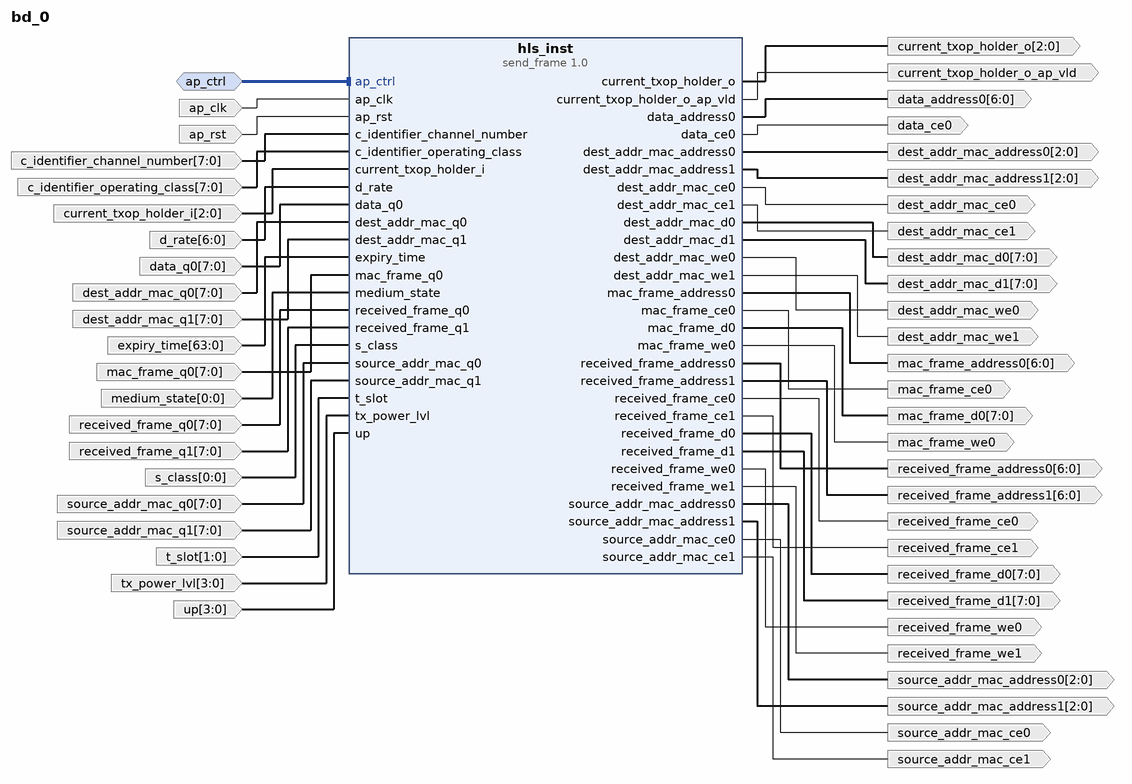
[diagram p0: block diagram of the top level]
# Vivado block design bd_0, xc7a35tcpg236-1, Vivado 2019.2
create_bd_design bd_0

create_bd_intf_port -mode Slave -vlnv xilinx.com:interface:acc_handshake_rtl:1.0 ap_ctrl
create_bd_port -dir I -type clk ap_clk
set_property -dict {CONFIG.FREQ_HZ 100000000.0} [get_bd_ports ap_clk]
create_bd_port -dir I -type rst ap_rst
set_property -dict {CONFIG.POLARITY ACTIVE_HIGH} [get_bd_ports ap_rst]
create_bd_port -dir I -from 7 -to 0 -type data c_identifier_channel_number
create_bd_port -dir I -from 7 -to 0 -type data c_identifier_operating_class
create_bd_port -dir I -from 2 -to 0 -type data current_txop_holder_i
create_bd_port -dir O -from 2 -to 0 -type data current_txop_holder_o
create_bd_port -dir O current_txop_holder_o_ap_vld
create_bd_port -dir I -from 6 -to 0 -type data d_rate
create_bd_port -dir O -from 6 -to 0 -type data data_address0
create_bd_port -dir O data_ce0
create_bd_port -dir I -from 7 -to 0 -type data data_q0
create_bd_port -dir O -from 2 -to 0 -type data dest_addr_mac_address0
create_bd_port -dir O -from 2 -to 0 -type data dest_addr_mac_address1
create_bd_port -dir O dest_addr_mac_ce0
create_bd_port -dir O dest_addr_mac_ce1
create_bd_port -dir O -from 7 -to 0 -type data dest_addr_mac_d0
create_bd_port -dir O -from 7 -to 0 -type data dest_addr_mac_d1
create_bd_port -dir I -from 7 -to 0 -type data dest_addr_mac_q0
create_bd_port -dir I -from 7 -to 0 -type data dest_addr_mac_q1
create_bd_port -dir O dest_addr_mac_we0
create_bd_port -dir O dest_addr_mac_we1
create_bd_port -dir I -from 63 -to 0 -type data expiry_time
create_bd_port -dir O -from 6 -to 0 -type data mac_frame_address0
create_bd_port -dir O mac_frame_ce0
create_bd_port -dir O -from 7 -to 0 -type data mac_frame_d0
create_bd_port -dir I -from 7 -to 0 -type data mac_frame_q0
create_bd_port -dir O mac_frame_we0
create_bd_port -dir I -from 0 -to 0 -type data medium_state
create_bd_port -dir O -from 6 -to 0 -type data received_frame_address0
create_bd_port -dir O -from 6 -to 0 -type data received_frame_address1
create_bd_port -dir O received_frame_ce0
create_bd_port -dir O received_frame_ce1
create_bd_port -dir O -from 7 -to 0 -type data received_frame_d0
create_bd_port -dir O -from 7 -to 0 -type data received_frame_d1
create_bd_port -dir I -from 7 -to 0 -type data received_frame_q0
create_bd_port -dir I -from 7 -to 0 -type data received_frame_q1
create_bd_port -dir O received_frame_we0
create_bd_port -dir O received_frame_we1
create_bd_port -dir I -from 0 -to 0 -type data s_class
create_bd_port -dir O -from 2 -to 0 -type data source_addr_mac_address0
create_bd_port -dir O -from 2 -to 0 -type data source_addr_mac_address1
create_bd_port -dir O source_addr_mac_ce0
create_bd_port -dir O source_addr_mac_ce1
create_bd_port -dir I -from 7 -to 0 -type data source_addr_mac_q0
create_bd_port -dir I -from 7 -to 0 -type data source_addr_mac_q1
create_bd_port -dir I -from 1 -to 0 -type data t_slot
create_bd_port -dir I -from 3 -to 0 -type data tx_power_lvl
create_bd_port -dir I -from 3 -to 0 -type data up

create_bd_cell -type ip -vlnv jt:hls:send_frame:1.0 hls_inst

# ---- connections ----

connect_bd_intf_net -intf_net ap_ctrl_0_1 [get_bd_intf_ports ap_ctrl] [get_bd_intf_pins hls_inst/ap_ctrl]
connect_bd_net -net ap_clk_0_1 [get_bd_ports ap_clk] [get_bd_pins hls_inst/ap_clk]
connect_bd_net -net ap_rst_0_1 [get_bd_ports ap_rst] [get_bd_pins hls_inst/ap_rst]
connect_bd_net -net c_identifier_channel_number_0_1 [get_bd_ports c_identifier_channel_number] [get_bd_pins hls_inst/c_identifier_channel_number]
connect_bd_net -net c_identifier_operating_class_0_1 [get_bd_ports c_identifier_operating_class] [get_bd_pins hls_inst/c_identifier_operating_class]
connect_bd_net -net current_txop_holder_i_0_1 [get_bd_ports current_txop_holder_i] [get_bd_pins hls_inst/current_txop_holder_i]
connect_bd_net [get_bd_pins hls_inst/current_txop_holder_o] [get_bd_ports current_txop_holder_o]
connect_bd_net [get_bd_pins hls_inst/current_txop_holder_o_ap_vld] [get_bd_ports current_txop_holder_o_ap_vld]
connect_bd_net -net d_rate_0_1 [get_bd_ports d_rate] [get_bd_pins hls_inst/d_rate]
connect_bd_net [get_bd_pins hls_inst/data_address0] [get_bd_ports data_address0]
connect_bd_net [get_bd_pins hls_inst/data_ce0] [get_bd_ports data_ce0]
connect_bd_net -net data_q0_0_1 [get_bd_ports data_q0] [get_bd_pins hls_inst/data_q0]
connect_bd_net [get_bd_pins hls_inst/dest_addr_mac_address0] [get_bd_ports dest_addr_mac_address0]
connect_bd_net [get_bd_pins hls_inst/dest_addr_mac_address1] [get_bd_ports dest_addr_mac_address1]
connect_bd_net [get_bd_pins hls_inst/dest_addr_mac_ce0] [get_bd_ports dest_addr_mac_ce0]
connect_bd_net [get_bd_pins hls_inst/dest_addr_mac_ce1] [get_bd_ports dest_addr_mac_ce1]
connect_bd_net [get_bd_pins hls_inst/dest_addr_mac_d0] [get_bd_ports dest_addr_mac_d0]
connect_bd_net [get_bd_pins hls_inst/dest_addr_mac_d1] [get_bd_ports dest_addr_mac_d1]
connect_bd_net -net dest_addr_mac_q0_0_1 [get_bd_ports dest_addr_mac_q0] [get_bd_pins hls_inst/dest_addr_mac_q0]
connect_bd_net -net dest_addr_mac_q1_0_1 [get_bd_ports dest_addr_mac_q1] [get_bd_pins hls_inst/dest_addr_mac_q1]
connect_bd_net [get_bd_pins hls_inst/dest_addr_mac_we0] [get_bd_ports dest_addr_mac_we0]
connect_bd_net [get_bd_pins hls_inst/dest_addr_mac_we1] [get_bd_ports dest_addr_mac_we1]
connect_bd_net -net expiry_time_0_1 [get_bd_ports expiry_time] [get_bd_pins hls_inst/expiry_time]
connect_bd_net [get_bd_pins hls_inst/mac_frame_address0] [get_bd_ports mac_frame_address0]
connect_bd_net [get_bd_pins hls_inst/mac_frame_ce0] [get_bd_ports mac_frame_ce0]
connect_bd_net [get_bd_pins hls_inst/mac_frame_d0] [get_bd_ports mac_frame_d0]
connect_bd_net -net mac_frame_q0_0_1 [get_bd_ports mac_frame_q0] [get_bd_pins hls_inst/mac_frame_q0]
connect_bd_net [get_bd_pins hls_inst/mac_frame_we0] [get_bd_ports mac_frame_we0]
connect_bd_net -net medium_state_0_1 [get_bd_ports medium_state] [get_bd_pins hls_inst/medium_state]
connect_bd_net [get_bd_pins hls_inst/received_frame_address0] [get_bd_ports received_frame_address0]
connect_bd_net [get_bd_pins hls_inst/received_frame_address1] [get_bd_ports received_frame_address1]
connect_bd_net [get_bd_pins hls_inst/received_frame_ce0] [get_bd_ports received_frame_ce0]
connect_bd_net [get_bd_pins hls_inst/received_frame_ce1] [get_bd_ports received_frame_ce1]
connect_bd_net [get_bd_pins hls_inst/received_frame_d0] [get_bd_ports received_frame_d0]
connect_bd_net [get_bd_pins hls_inst/received_frame_d1] [get_bd_ports received_frame_d1]
connect_bd_net -net received_frame_q0_0_1 [get_bd_ports received_frame_q0] [get_bd_pins hls_inst/received_frame_q0]
connect_bd_net -net received_frame_q1_0_1 [get_bd_ports received_frame_q1] [get_bd_pins hls_inst/received_frame_q1]
connect_bd_net [get_bd_pins hls_inst/received_frame_we0] [get_bd_ports received_frame_we0]
connect_bd_net [get_bd_pins hls_inst/received_frame_we1] [get_bd_ports received_frame_we1]
connect_bd_net -net s_class_0_1 [get_bd_ports s_class] [get_bd_pins hls_inst/s_class]
connect_bd_net [get_bd_pins hls_inst/source_addr_mac_address0] [get_bd_ports source_addr_mac_address0]
connect_bd_net [get_bd_pins hls_inst/source_addr_mac_address1] [get_bd_ports source_addr_mac_address1]
connect_bd_net [get_bd_pins hls_inst/source_addr_mac_ce0] [get_bd_ports source_addr_mac_ce0]
connect_bd_net [get_bd_pins hls_inst/source_addr_mac_ce1] [get_bd_ports source_addr_mac_ce1]
connect_bd_net -net source_addr_mac_q0_0_1 [get_bd_ports source_addr_mac_q0] [get_bd_pins hls_inst/source_addr_mac_q0]
connect_bd_net -net source_addr_mac_q1_0_1 [get_bd_ports source_addr_mac_q1] [get_bd_pins hls_inst/source_addr_mac_q1]
connect_bd_net -net t_slot_0_1 [get_bd_ports t_slot] [get_bd_pins hls_inst/t_slot]
connect_bd_net -net tx_power_lvl_0_1 [get_bd_ports tx_power_lvl] [get_bd_pins hls_inst/tx_power_lvl]
connect_bd_net -net up_0_1 [get_bd_ports up] [get_bd_pins hls_inst/up]

validate_bd_design
save_bd_design
